# Altium project UCC28740DR Flyback converter.PrjPcb
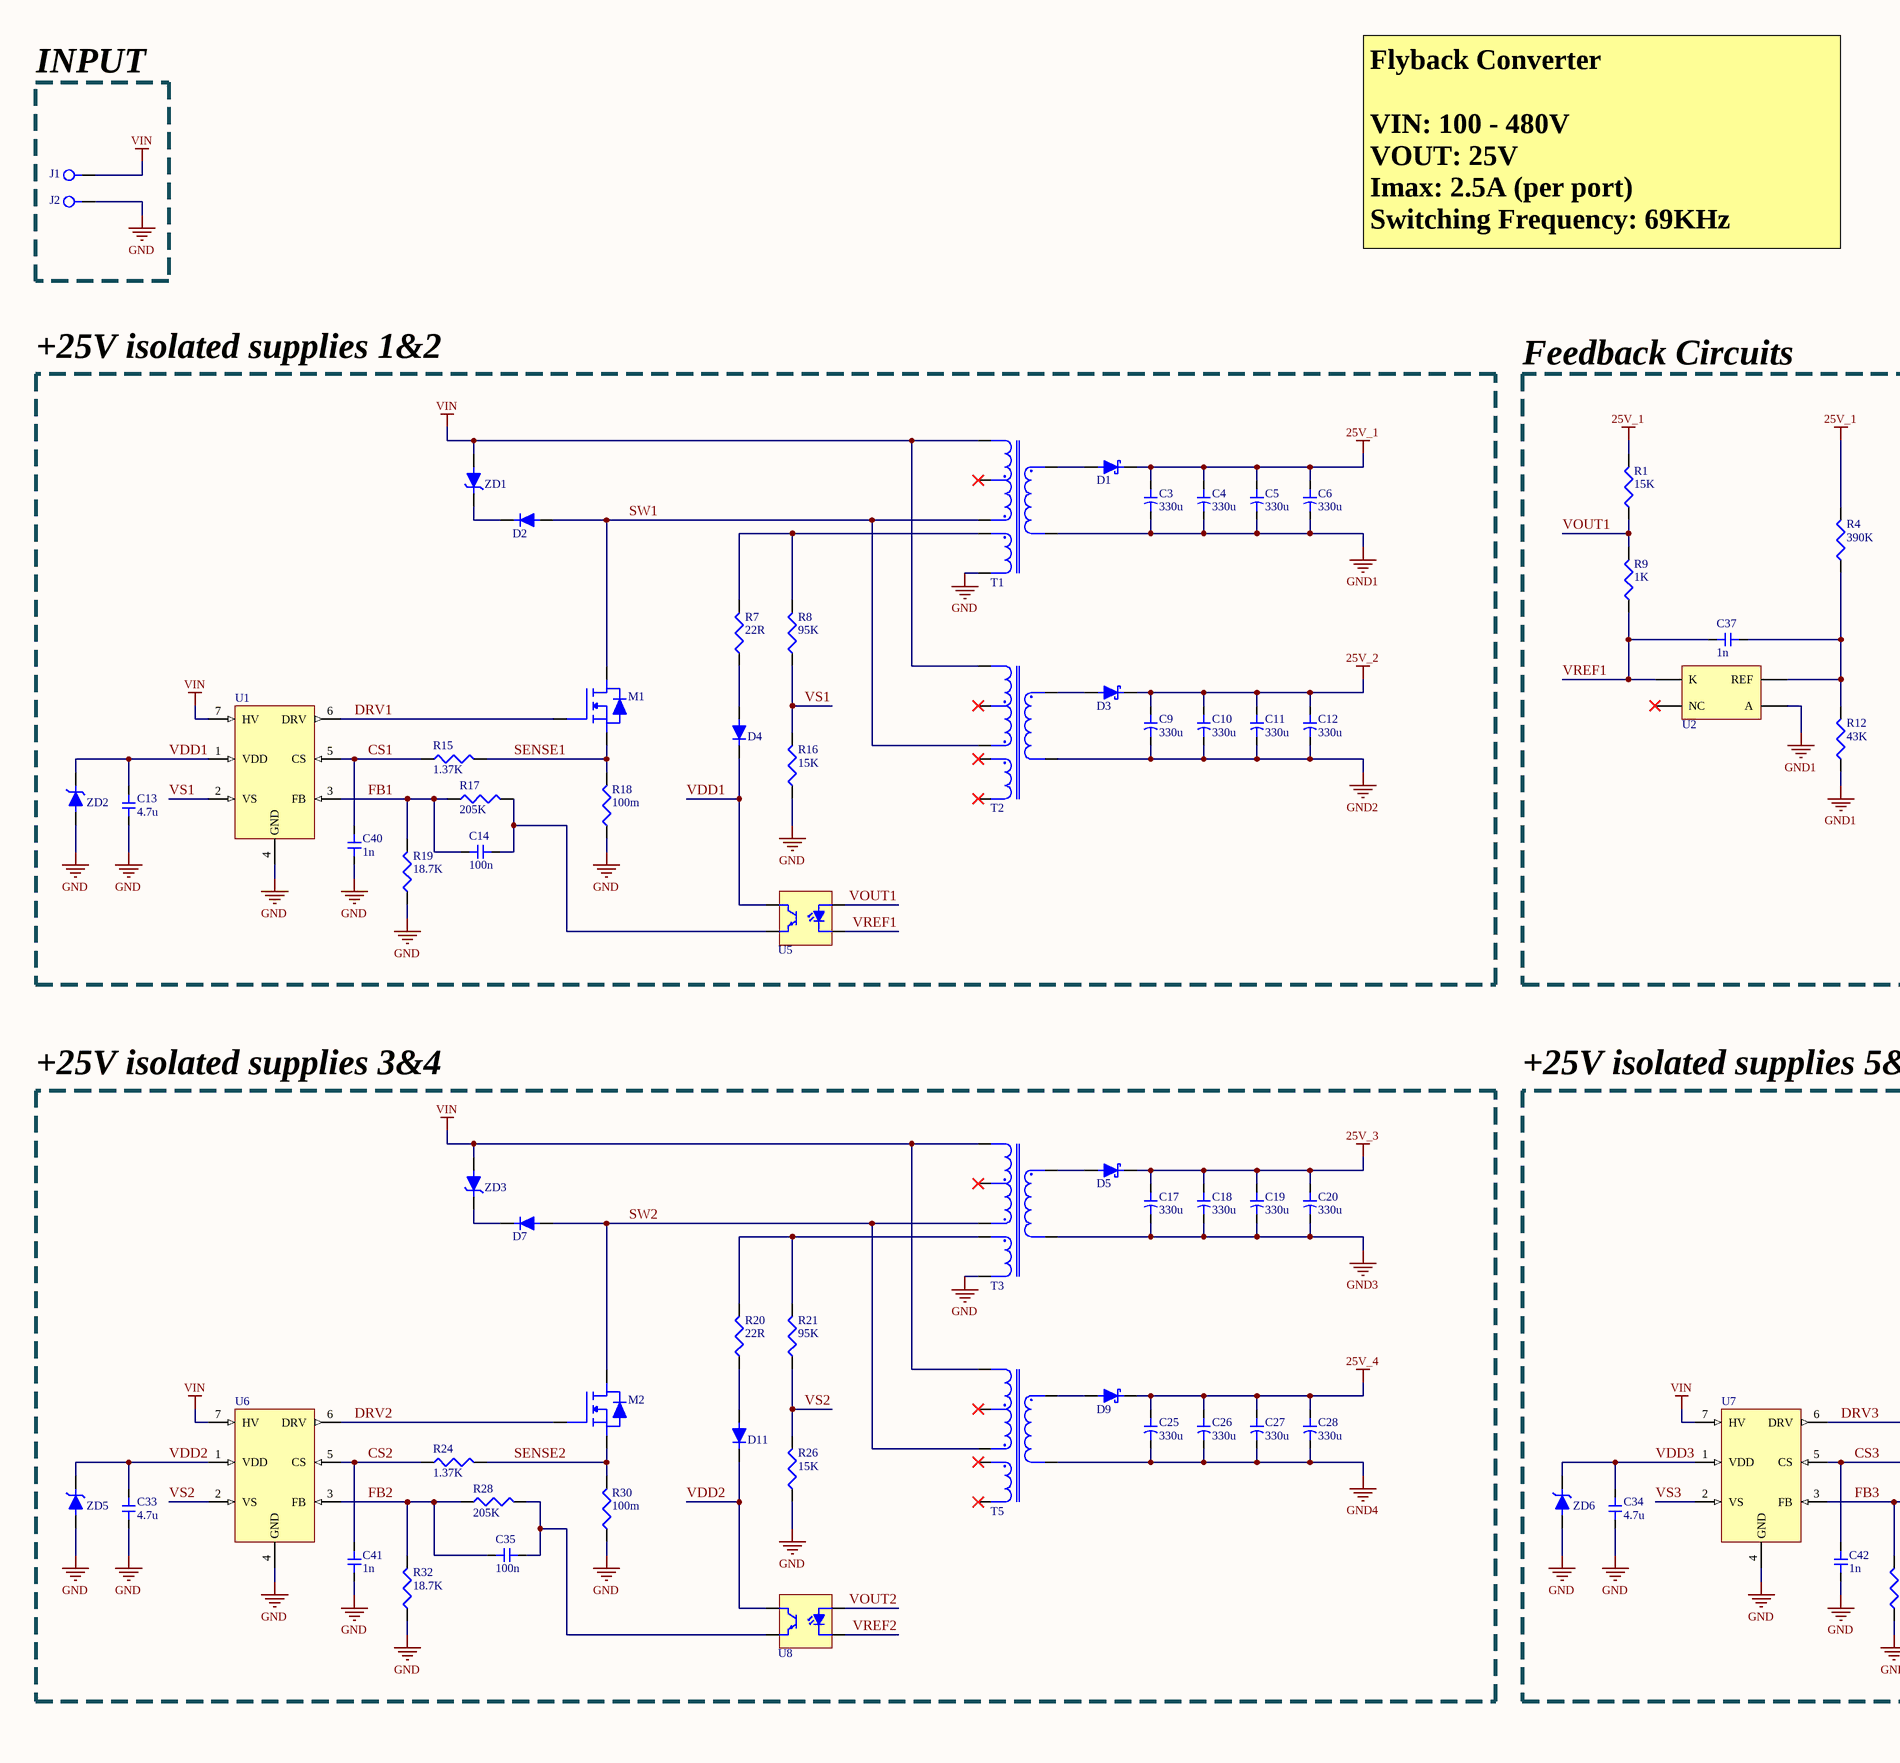
[diagram p0: UCC28740DR Flyback converter SCH.SchDoc, left]
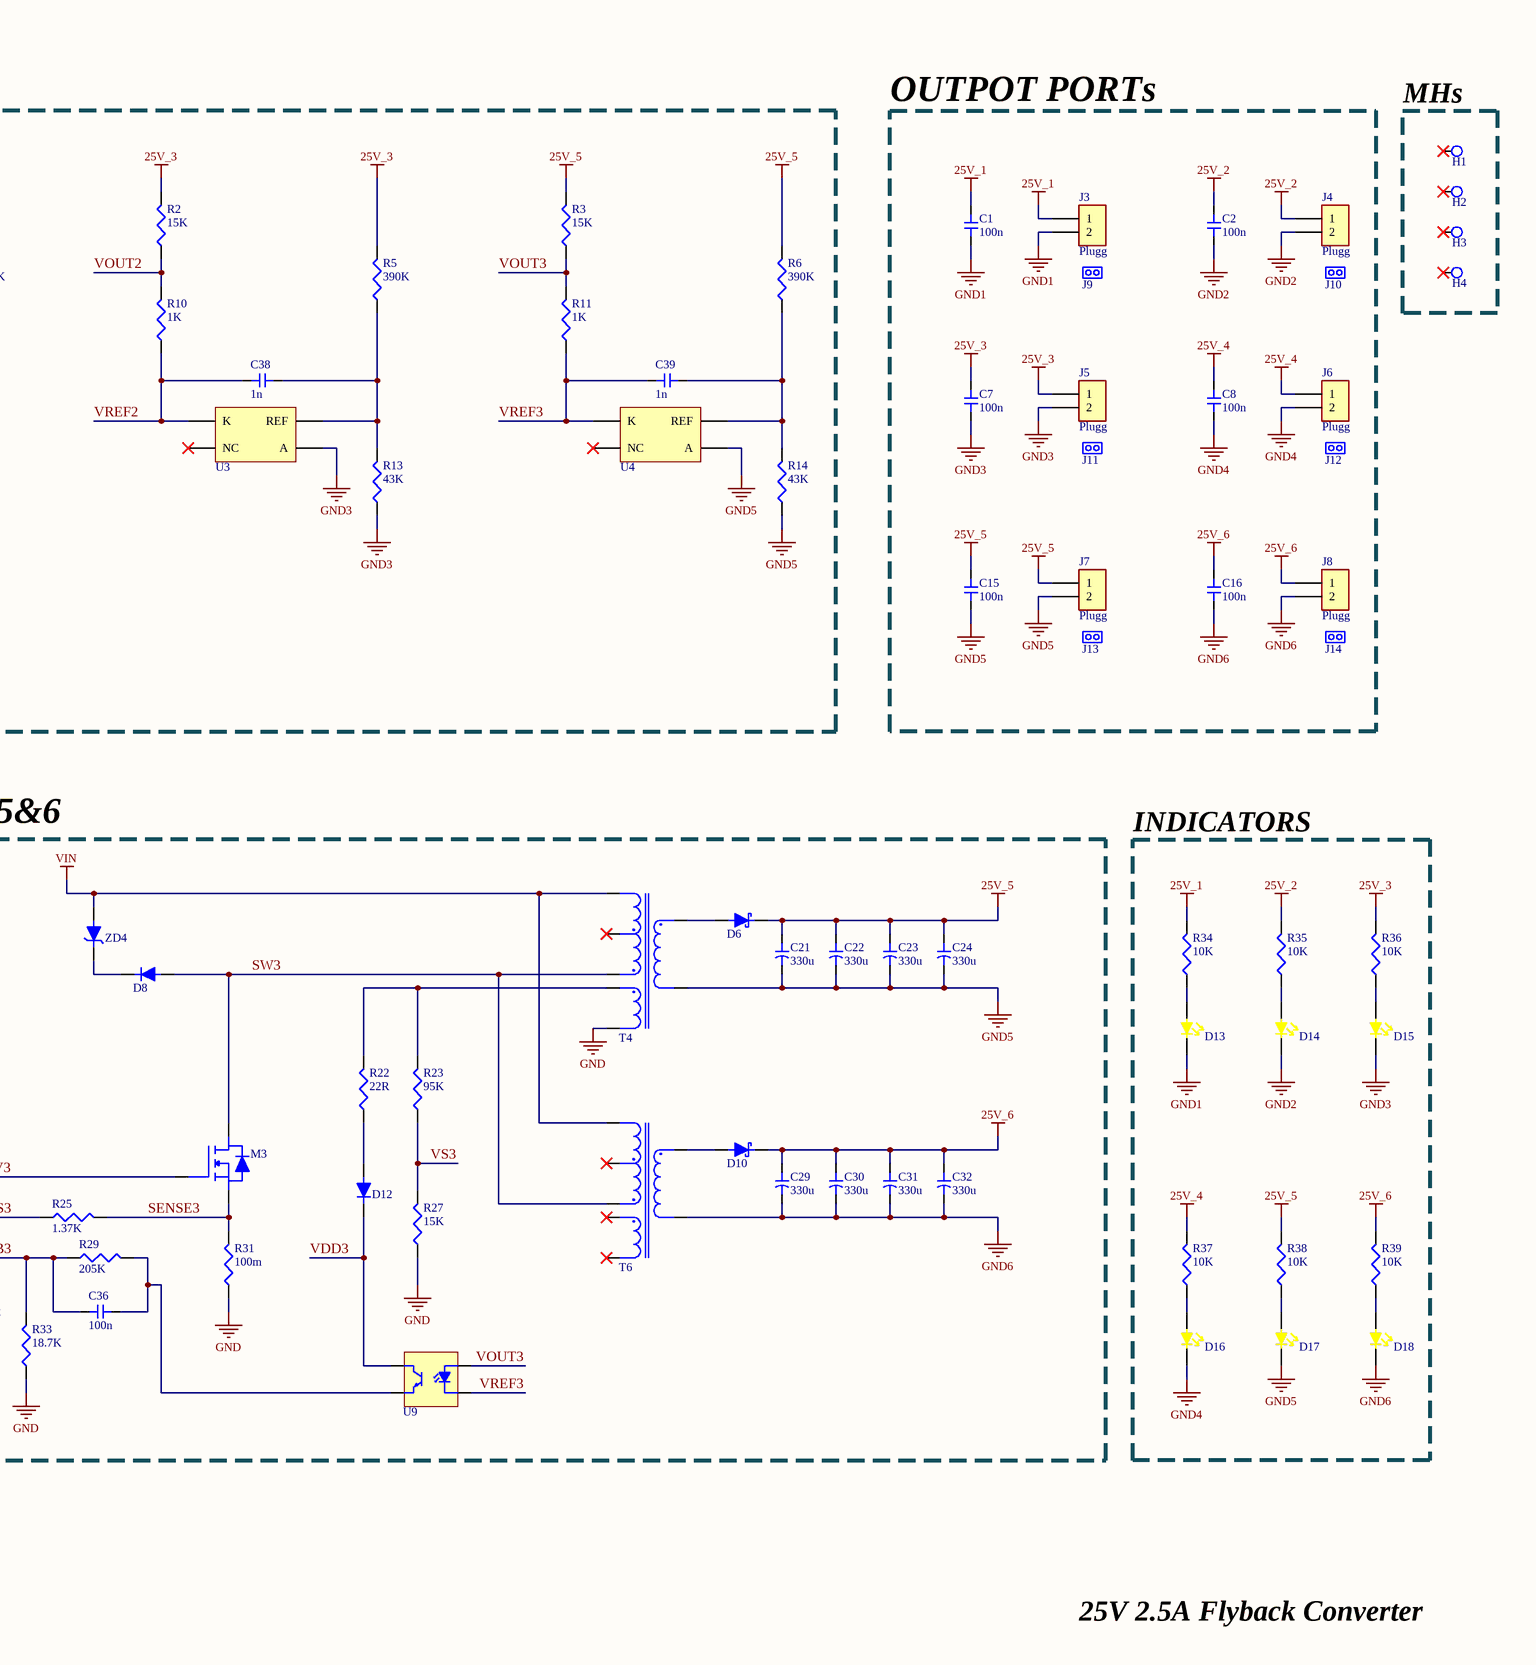
[diagram p1: UCC28740DR Flyback converter SCH.SchDoc, right]
1 sheet, 141 parts. Net scope: global (net labels, ports and power ports of the same name join across sheets).
Board file: UCC28740DR Flyback converter PCB.PcbDoc

## Sheet UCC28740DR Flyback converter SCH.SchDoc
size 665 x 381 mm; SheetNumber: 1; SheetTotal: 1

### Parts
C1  100n  [0603-CAP]
C2  100n  [0603-CAP]
C3  330u  [Electrolytic Capacitor D13 P5 H25]
C4  330u  [Electrolytic Capacitor D13 P5 H25]
C5  330u  [Electrolytic Capacitor D13 P5 H25]
C6  330u  [Electrolytic Capacitor D13 P5 H25]
C7  100n  [0603-CAP]
C8  100n  [0603-CAP]
C9  330u  [Electrolytic Capacitor D13 P5 H25]
C10  330u  [Electrolytic Capacitor D13 P5 H25]
C11  330u  [Electrolytic Capacitor D13 P5 H25]
C12  330u  [Electrolytic Capacitor D13 P5 H25]
C13  4.7u  [0805-CAP]
C14  100n  [0603-CAP]
C15  100n  [0603-CAP]
C16  100n  [0603-CAP]
C17  330u  [Electrolytic Capacitor D13 P5 H25]
C18  330u  [Electrolytic Capacitor D13 P5 H25]
C19  330u  [Electrolytic Capacitor D13 P5 H25]
C20  330u  [Electrolytic Capacitor D13 P5 H25]
C21  330u  [Electrolytic Capacitor D13 P5 H25]
C22  330u  [Electrolytic Capacitor D13 P5 H25]
C23  330u  [Electrolytic Capacitor D13 P5 H25]
C24  330u  [Electrolytic Capacitor D13 P5 H25]
C25  330u  [Electrolytic Capacitor D13 P5 H25]
C26  330u  [Electrolytic Capacitor D13 P5 H25]
C27  330u  [Electrolytic Capacitor D13 P5 H25]
C28  330u  [Electrolytic Capacitor D13 P5 H25]
C29  330u  [Electrolytic Capacitor D13 P5 H25]
C30  330u  [Electrolytic Capacitor D13 P5 H25]
C31  330u  [Electrolytic Capacitor D13 P5 H25]
C32  330u  [Electrolytic Capacitor D13 P5 H25]
C33  4.7u  [0805-CAP]
C34  4.7u  [0805-CAP]
C35  100n  [0603-CAP]
C36  100n  [0603-CAP]
C37  1n  [0603-CAP]
C38  1n  [0603-CAP]
C39  1n  [0603-CAP]
C40  1n  [0603-CAP]
C41  1n  [0603-CAP]
C42  1n  [0603-CAP]
D1  Schottky Diode  [SMA(DO-214AC)]  (value not drawn)
D2  Fast Diode  [SMC diode]  (value not drawn)
D3  Schottky Diode  [SMA(DO-214AC)]  (value not drawn)
D4  Fast Diode  [SMC diode]  (value not drawn)
D5  Schottky Diode  [SMA(DO-214AC)]  (value not drawn)
D6  Schottky Diode  [SMA(DO-214AC)]  (value not drawn)
D7  Fast Diode  [SMC diode]  (value not drawn)
D8  Fast Diode  [SMC diode]  (value not drawn)
D9  Schottky Diode  [SMA(DO-214AC)]  (value not drawn)
D10  Schottky Diode  [SMA(DO-214AC)]  (value not drawn)
D11  Fast Diode  [SMC diode]  (value not drawn)
D12  Fast Diode  [SMC diode]  (value not drawn)
D13  Yellow LED  [yellow led]  (value not drawn)
D14  Yellow LED  [yellow led]  (value not drawn)
D15  Yellow LED  [yellow led]  (value not drawn)
D16  Yellow LED  [yellow led]  (value not drawn)
D17  Yellow LED  [yellow led]  (value not drawn)
D18  Yellow LED  [yellow led]  (value not drawn)
H1  Mounting hole  [Monting Hole]  (value not drawn)  (no BOM)
H2  Mounting hole  [Monting Hole]  (value not drawn)  (no BOM)
H3  Mounting hole  [Monting Hole]  (value not drawn)  (no BOM)
H4  Mounting hole  [Monting Hole]  (value not drawn)  (no BOM)
J1  Banana Connector Red  [Bannana Connector Red]  (value not drawn)
J2  Banana Connector Black  [Bannana Connector Black]  (value not drawn)
J3  Plugg  [Pluggable Terminal Block 2]
J4  Plugg  [Pluggable Terminal Block 2]
J5  Plugg  [Pluggable Terminal Block 2]
J6  Plugg  [Pluggable Terminal Block 2]
J7  Plugg  [Pluggable Terminal Block 2]
J8  Plugg  [Pluggable Terminal Block 2]
J9  Pluggable Rozzeta 2P female  (value not drawn)  (graphical)
J10  Pluggable Rozzeta 2P female  (value not drawn)  (graphical)
J11  Pluggable Rozzeta 2P female  (value not drawn)  (graphical)
J12  Pluggable Rozzeta 2P female  (value not drawn)  (graphical)
J13  Pluggable Rozzeta 2P female  (value not drawn)  (graphical)
J14  Pluggable Rozzeta 2P female  (value not drawn)  (graphical)
M1  650V 20A MOSFET  [TO-263]  (value not drawn)
M2  650V 20A MOSFET  [TO-263]  (value not drawn)
M3  650V 20A MOSFET  [TO-263]  (value not drawn)
R1  15K  [0603-RES]
R2  15K  [0603-RES]
R3  15K  [0603-RES]
R4  390K  [0603-RES]
R5  390K  [0603-RES]
R6  390K  [0603-RES]
R7  22R  [0603-RES]
R8  95K  [0603-RES]
R9  1K  [0603-RES]
R10  1K  [0603-RES]
R11  1K  [0603-RES]
R12  43K  [0603-RES]
R13  43K  [0603-RES]
R14  43K  [0603-RES]
R15  1.37K  [0603-RES]
R16  15K  [0603-RES]
R17  205K  [0603-RES]
R18  100m  [0603-RES]
R19  18.7K  [0603-RES]
R20  22R  [0603-RES]
R21  95K  [0603-RES]
R22  22R  [0603-RES]
R23  95K  [0603-RES]
R24  1.37K  [0603-RES]
R25  1.37K  [0603-RES]
R26  15K  [0603-RES]
R27  15K  [0603-RES]
R28  205K  [0603-RES]
R29  205K  [0603-RES]
R30  100m  [0603-RES]
R31  100m  [0603-RES]
R32  18.7K  [0603-RES]
R33  18.7K  [0603-RES]
R34  10K  [0603-RES]
R35  10K  [0603-RES]
R36  10K  [0603-RES]
R37  10K  [0603-RES]
R38  10K  [0603-RES]
R39  10K  [0603-RES]
T1  750343068  [29.2x30.35 Transformer]  (value not drawn)
T2  750343068  [29.2x30.35 Transformer]  (value not drawn)
T3  750343068  [29.2x30.35 Transformer]  (value not drawn)
T4  750343068  [29.2x30.35 Transformer]  (value not drawn)
T5  750343068  [29.2x30.35 Transformer]  (value not drawn)
T6  750343068  [29.2x30.35 Transformer]  (value not drawn)
U1  UCC2870DR  [SOIC-7]  (value not drawn)
U2  TL431IDBVR  [SOT-23-5]  (value not drawn)
U3  TL431IDBVR  [SOT-23-5]  (value not drawn)
U4  TL431IDBVR  [SOT-23-5]  (value not drawn)
U5  Optocoupler  [SMD-4P Optocoupler]  (value not drawn)
U6  UCC2870DR  [SOIC-7]  (value not drawn)
U7  UCC2870DR  [SOIC-7]  (value not drawn)
U8  Optocoupler  [SMD-4P Optocoupler]  (value not drawn)
U9  Optocoupler  [SMD-4P Optocoupler]  (value not drawn)
ZD1  Zener Diode 120V  [SMB Zener diode]  (value not drawn)
ZD2  Zener Diode 24V  [SMA(DO-214AC)]  (value not drawn)
ZD3  Zener Diode 120V  [SMB Zener diode]  (value not drawn)
ZD4  Zener Diode 120V  [SMB Zener diode]  (value not drawn)
ZD5  Zener Diode 24V  [SMA(DO-214AC)]  (value not drawn)
ZD6  Zener Diode 24V  [SMA(DO-214AC)]  (value not drawn)

### Blocks framed on the sheet
INPUT: J1 J2
+25V isolated supplies 1&2: C3-C6 C9-C14 C40 D1-D4 M1 R7 R8 R15-R19 T1 T2 U1 U5 ZD1 ZD2
Feedback Circuits: C37-C39 R1-R6 R9-R14 U2-U4
OUTPOT PORTs: C1 C2 C7 C8 C15 C16 J3-J14
MHs: H1-H4
+25V isolated supplies 3&4: C17-C20 C25-C28 C33 C35 C41 D5 D7 D9 D11 M2 R20 R21 R24 R26 R28 R30 R32 T3 T5 U6 U8 ZD3 ZD5
+25V isolated supplies 5&6: C21-C24 C29-C32 C34 C36 C42 D6 D8 D10 D12 M3 R22 R23 R25 R27 R29 R31 R33 T4 T6 U7 U9 ZD4 ZD6
INDICATORS: D13-D18 R34-R39

### Nets
25V_1: C1.1 C3.2 C4.2 C5.2 C6.2 D1.1(Cathode) J3.1 R1.2 R4.2 R34.2
25V_2: C2.1 C9.2 C10.2 C11.2 C12.2 D3.1(Cathode) J4.1 R35.2
25V_3: C7.1 C17.2 C18.2 C19.2 C20.2 D5.1(Cathode) J5.1 R2.2 R5.2 R36.2
25V_4: C8.1 C25.2 C26.2 C27.2 C28.2 D9.1(Cathode) J6.1 R37.2
25V_5: C15.1 C21.2 C22.2 C23.2 C24.2 D6.1(Cathode) J7.1 R3.2 R6.2 R38.2
25V_6: C16.1 C29.2 C30.2 C31.2 C32.2 D10.1(Cathode) J8.1 R39.2
GND: C13.2 C33.2 C34.2 C40.2 C41.2 C42.2 J2.1 R16.1 R18.1 R19.1 R26.1 R27.1 R30.1 R31.1 R32.1 R33.1 T1.6 T3.6 T4.6 U1.4(GND) U6.4(GND) U7.4(GND) ZD2.2(Anode) ZD5.2(Anode) ZD6.2(Anode)
GND1: C1.2 C3.1 C4.1 C5.1 C6.1 D13.2 J3.2 R12.1 T1.10 U2.5(A)
GND2: C2.2 C9.1 C10.1 C11.1 C12.1 D14.2 J4.2 T2.10
GND3: C7.2 C17.1 C18.1 C19.1 C20.1 D15.2 J5.2 R13.1 T3.10 U3.5(A)
GND4: C8.2 C25.1 C26.1 C27.1 C28.1 D16.2 J6.2 T5.10
GND5: C15.2 C21.1 C22.1 C23.1 C24.1 D17.2 J7.2 R14.1 T4.10 U4.5(A)
GND6: C16.2 C29.1 C30.1 C31.1 C32.1 D18.2 J8.2 T6.10
VIN: J1.1 T1.1 T2.1 T3.1 T4.1 T5.1 T6.1 U1.7(HV) U6.7(HV) U7.7(HV) ZD1.2(Anode) ZD3.2(Anode) ZD4.2(Anode)
CS1: C40.1 R15.1 U1.5(CS)
CS2: C41.1 R24.1 U6.5(CS)
CS3: C42.1 R25.1 U7.5(CS)
DRV1: M1.1(Gate) U1.6(DRV)
DRV2: M2.1(Gate) U6.6(DRV)
DRV3: M3.1(Gate) U7.6(DRV)
FB1: C14.2 R17.1 R19.2 U1.3(FB)
FB2: C35.2 R28.1 R32.2 U6.3(FB)
FB3: C36.2 R29.1 R33.2 U7.3(FB)
SENSE1: M1.3(Source) R15.2 R18.2
SENSE2: M2.3(Source) R24.2 R30.2
SENSE3: M3.3(Source) R25.2 R31.2
SW1: D2.2(Anode) M1.2(Drain) T1.3 T2.3
SW2: D7.2(Anode) M2.2(Drain) T3.3 T5.3
SW3: D8.2(Anode) M3.2(Drain) T4.3 T6.3
VDD1: C13.1 D4.1(Cathode) U1.1(VDD) U5.3 ZD2.1(Cathode)
VDD2: C33.1 D11.1(Cathode) U6.1(VDD) U8.3 ZD5.1(Cathode)
VDD3: C34.1 D12.1(Cathode) U7.1(VDD) U9.3 ZD6.1(Cathode)
VOUT1: R1.1 R9.2 U5.1
VOUT2: R2.1 R10.2 U8.1
VOUT3: R3.1 R11.2 U9.1
VREF1: C37.1 R9.1 U2.3(K) U5.2
VREF2: C38.2 R10.1 U3.3(K) U8.2
VREF3: C39.2 R11.1 U4.3(K) U9.2
VS1: R8.1 R16.2 U1.2(VS)
VS2: R21.1 R26.2 U6.2(VS)
VS3: R23.1 R27.2 U7.2(VS)
NetC14_1: C14.1 R17.2 U5.4
NetC35_1: C35.1 R28.2 U8.4
NetC36_1: C36.1 R29.2 U9.4
NetC37_2: C37.2 R4.1 R12.2 U2.4(REF)
NetC38_1: C38.1 R5.1 R13.2 U3.4(REF)
NetC39_1: C39.1 R6.1 R14.2 U4.4(REF)
NetD1_2: D1.2(Anode) T1.12
NetD2_1: D2.1(Cathode) ZD1.1(Cathode)
NetD3_2: D3.2(Anode) T2.12
NetD4_2: D4.2(Anode) R7.1
NetD5_2: D5.2(Anode) T3.12
NetD6_2: D6.2(Anode) T4.12
NetD7_1: D7.1(Cathode) ZD3.1(Cathode)
NetD8_1: D8.1(Cathode) ZD4.1(Cathode)
NetD9_2: D9.2(Anode) T5.12
NetD10_2: D10.2(Anode) T6.12
NetD11_2: D11.2(Anode) R20.1
NetD12_2: D12.2(Anode) R22.1
NetD13_1: D13.1 R34.1
NetD14_1: D14.1 R35.1
NetD15_1: D15.1 R36.1
NetD16_1: D16.1 R37.1
NetD17_1: D17.1 R38.1
NetD18_1: D18.1 R39.1
NetR7_2: R7.2 R8.2 T1.7
NetR20_2: R20.2 R21.2 T3.7
NetR22_2: R22.2 R23.2 T4.7

Not connected (* = marked no-connect by the designer): H1 1*; H2 1*; H3 1*; H4 1*; T1 2*; T2 2* 6* 7*; T3 2*; T4 2*; T5 2* 6* 7*; T6 2* 6* 7*; U2 1(NC)*; U3 1(NC)*; U4 1(NC)*

### Notes on the sheet
- Flyback Converter
  VIN: 100 - 480V
  VOUT: 25V
  Imax: 2.5A (per port)
  Switching Frequency: 69KHz
- 25V 2.5A Flyback Converter

### Library data of the parts
C1 C2 C7 C8 C14-C16 C35 C36 = Cap 100nF: 50V 100nF X7R ±10% 0603 Multilayer Ceramic Capacitors MLCC - SMD/SMT ROHS; Manufacturer: YAGEO; Mfr. part #: CC0603KRX7R9BB104; Supplier: LCSC ELECTRONICS; Supplier part #: C14663; Price: 0.002
C3-C6 C9-C12 C17-C32 = Electrolytic Cap 330u: 330uF 100V Plugin,D13xL26mm Aluminum Electrolytic Capacitors - Leaded ROHS; Manufacturer: HRK; Mfr. part #: CD2883372AM1326VFL; Supplier: LCSC ELECTRONICS; Supplier part #: C7493849; Price: 0.1684
C13 C33 C34 = Cap 4.7uF: 50V 4.7uF X7R ±10% 0805 Multilayer Ceramic Capacitors MLCC - SMD/SMT ROHS; Manufacturer: FH (Guangdong Fenghua Advanced Tech); Mfr. part #: 0805B475K500NT; Supplier: LCSC ELECTRONICS; Supplier part #: C2991173; Price: 0.0363
C37-C42 = Cap 1nF: 50V 1nF X7R ±10% 0603 Multilayer Ceramic Capacitors MLCC - SMD/SMT ROHS; Manufacturer: YAGEO; Mfr. part #: CC0603KRX7R9BB102; Supplier: LCSC ELECTRONICS; Supplier part #: C100040; Price: 0.002
D1 D3 D5 D6 D9 D10 = Schottky Diode: 100V Independent Type 850mV@5A 5A SMA(DO-214AC) Schottky Diodes ROHS; Manufacturer: TWGMC; Mfr. part #: SS510; Supplier: LCSC ELECTRONICS; Supplier part #: C727067; Price: 0.0458
D2 D4 D7 D8 D11 D12 = Fast Diode: 1.7V@8A 80ns Independent Type 8A 1kV SMC Fast Recovery / High Efficiency Diodes ROHS; Manufacturer: Shandong Jingdao Microelectronics; Mfr. part #: US8MC; Supplier: LCSC ELECTRONICS; Supplier part #: C382940; Price: 0.0613
D13-D18 = Yellow LED: 2-Yellow lens-30℃~+85℃ Positive post White 120° 80mW 0805 Light Emitting Diodes (LED) ROHS; Manufacturer: XINGLIGHT; Mfr. part #: XL-2012UWC; supplier: LCSC ELECTRONICS; Supplier part #: C965818; Price: 0.0092
J1 = Banana Connector Red: Terminal Red Banana Connectors / Alligator Clips ROHS; Manufacturer: Changzhou Amass Elec; Mfr. part #: 24.247.1; Supplier: LCSC ELECTRONICS; Supplier part #: C106273; Price: 0.1796
J2 = Banana Connector Black: Terminal Black Banana Connectors / Alligator Clips ROHS; Manufacturer: Changzhou Amass Elec; Mfr. part #: 24.247.2; Supplier: LCSC ELECTRONICS; Supplier part #: C106272; Price: 0.1626
J3-J8 = Pluggable Rozzeta 2P: 2 Bend 1 5.08mm 1x2P Green Board Edge/Receptacle-Open Push-Pull,P=5.08mm Pluggable System Terminal Block; Mfr. part #: WJ2EDGR-5.08-2P; Manufacturer: Ningbo Kangnex Elec; Supplier: LCSC ELECTRONICS; Supplier part #: C8383; Price: 0.0342
J9-J14 = Pluggable Rozzeta 2P female: -40℃~+105℃ 2.5 1 14~28 5.08mm 450V 20A 2 Phosphor Bronze 1x2P Male Plug P=5.08mm Pluggable System Terminal Block ROHS; Mfr. part #: WJ2EDGK-5.08-2P; Manufacturer: Ningbo Kangnex Elec; Supplier: LCSC ELECTRONICS; Supplier part #: C71370; Price: 0.1319
M1-M3 = 650V 20A MOSFET: 650V 20A 190mΩ 126W 3.5V TO-263 MOSFETs ROHS; Manufacturer: ANHI; Mfr. part #: ASB65R220E; Supplier: LCSC ELECTRONICS; Supplier part #: C18199767; Price: 1.0433
R1-R3 R16 R26 R27 = Resistor 15K: 100mW Thick Film Resistors 75V ±100ppm/℃ ±1% 15kΩ 0603 Chip Resistor - Surface Mount ROHS; Manufacturer: FOJAN; Mfr. part #: FRC0603F1502TS; Supplier: LCSC ELECTRONICS; Supplier part #: C2906995; Price: 0.0009
R4-R6 = Resistor 390K: 100mW Thick Film Resistors 75V ±100ppm/℃ ±5% 390kΩ 0603 Chip Resistor - Surface Mount ROHS; Manufacturer: FOJAN; Mfr. part #: FRC0603J394 TS; Supplier: LCSC ELECTRONICS; Supplier part #: C2907158; Price: 0.0007
R7 R20 R22 = Resistor 22R: 100mW Thick Film Resistors 75V ±100ppm/℃ ±5% 22Ω 0603 Chip Resistor - Surface Mount ROHS; Manufacturer: FOJAN; Mfr. part #: FRC0603J220 TS; Supplier: LCSC ELECTRONICS; Supplier part #: C2907129; Price: 0.0007
R8 R21 R23 = Resistor 95K: 100mW Thick Film Resistors 75V ±100ppm/℃ ±1% 95.3kΩ 0603 Chip Resistor - Surface Mount ROHSFOJAN; Manufacturer: FOJAN; Mfr. part #: FRC0603F9532TS; Supplier: LCSC ELECTRONICS; Supplier part #: C2907078; Price: 0.0009
R9-R11 = Resistor 1K: 100mW Thick Film Resistors 75V ±100ppm/℃ ±5% 1kΩ 0603 Chip Resistor - Surface Mount ROHS; Manufacturer: FOJAN; Mfr. part #: FRC0603J102 TS; Supplier: LCSC ELECTRONICS; Supplier part #: C2907113; Price: 0.0008
R12-R14 = Resistor 43K: 100mW Thick Film Resistors 75V ±100ppm/℃ ±1% 43kΩ 0603 Chip Resistor - Surface Mount ROHS; Manufacturer: FOJAN; Mfr. part #: FRC0603F4302TS; Supplier: LCSC ELECTRONICS; Supplier part #: C2907038; Price: 0.0008
R15 R24 R25 = Resistor 1.37K: 100mW Thick Film Resistors 75V ±100ppm/℃ ±1% 1.37kΩ 0603 Chip Resistor - Surface Mount ROHS; Manufacturer: FOJAN; Mfr. part #: FRC0603F1371TS; Supplier: LCSC ELECTRONICS; Supplier part #: C2933142; Price: 0.0008
R17 R28 R29 = Resistor 205K: 100mW Thick Film Resistors 75V ±100ppm/℃ ±1% 205kΩ 0603 Chip Resistor - Surface Mount ROHS; Manufacturer: FOJAN; Mfr. part #: FRC0603F2053TS; Supplier: LCSC ELECTRONICS; Supplier part #: C5126104; Price: 0.0008
R18 R30 R31 = Resistor 100mohm: 100mW Thick Film Resistors 75V ±800ppm/℃ ±1% 140mΩ 0603 Chip Resistor - Surface Mount ROHS; Manufacturer: UNI-ROYAL(Uniroyal Elec); Mfr. part #: 0603WAJ010KT5E; Supplier: LCSC ELECTRONICS; Supplier part #: C247025; Price: 0.003
R19 R32 R33 = Resistor 18.7K: 100mW Thick Film Resistors 75V ±100ppm/℃ ±1% 18.7kΩ 0603 Chip Resistor - Surface Mount ROHS; Manufacturer: YAGEO; Mfr. part #: RC0603FR-0718K7L; Supplier: LCSC ELECTRONICS; Supplier part #: C273772; Price: 0.0012
R34-R39 = Resistor 10K: 100mW Thick Film Resistors 75V ±100ppm/℃ ±1% 10kΩ 0603 Chip Resistor - Surface Mount ROHS; Manufacturer: UNI-ROYAL(Uniroyal Elec); Mfr. part #: 0603WAF1002T5E; Supplier: LCSC ELECTRONICS; Supplier part #: C25804; Price: 0.0009
T1-T6 = Switching Transformer: Power Transformers MID-OLTI UCC28740 230 uH 60 W; Manufacturer: Wurth Elektronik; Mfr. part #: 750343068; Supplier: Mouser Electronics; Supplier part #: 710-750343068; Price: 11.13
U1 U6 U7 = UCC2870DR Flyback Controller: 170Hz~100kHz 9V~35V SOIC-7 AC-DC Controllers and Regulators ROHS; Manufacturer: Texas Instruments; Mfr. part #: UCC28740DR; Supplier: LCSC ELECTRONICS; Supplier part #: C182073; Price: 0.7506
U2-U4 = Adjustable Voltage reference: 2.495V~36V ±2.2% 100mA Adjustable SOT-23-5 Voltage Reference ROHS; Manufacturer: Texas Instruments; Mfr. part #: TL431IDBVR; Supplier: LCSC ELECTRONICS; Supplier part #: C350567; Price: 0.1527
U5 U8 U9 = Optocoupler: 80V 5kV 50mA 400mV@2.4mA,8mA 1 5V 1.15V DC SMD-4P Transistor, Photovoltaic Output Optoisolators ROHS; Manufacturer: TOSHIBA; Mfr. part #: TLP785(GB-TP6,F(C; Supplier: LCSC ELECTRONICS; Supplier part #: C45445; Price: 0.1007
ZD1 ZD3 ZD4 = Zener Diode 120V: Independent Type 114V~126V 3W 120V SMB Zener Diodes ROHS; Manufacturer: LGE; Mfr. part #: 3SMB5951B; Supplier: LCSC ELECTRONICS; Supplier part #: C2983228; Price: 0.0722
ZD2 ZD5 ZD6 = Zener Diode 24V: Independent Type 22.8V~26V 1W 24V SMA(DO-214AC) Zener Diodes ROHS; Manufacturer: MDD(Microdiode Semiconductor); Mfr. part #: 1SMA4749A; Supplier: LCSC ELECTRONICS; Supplier part #: C173489; Price: 0.0392